# Altium schematic sheet Sheet2.SchDoc
size A3; SheetNumber: 1; SheetTotal: 1
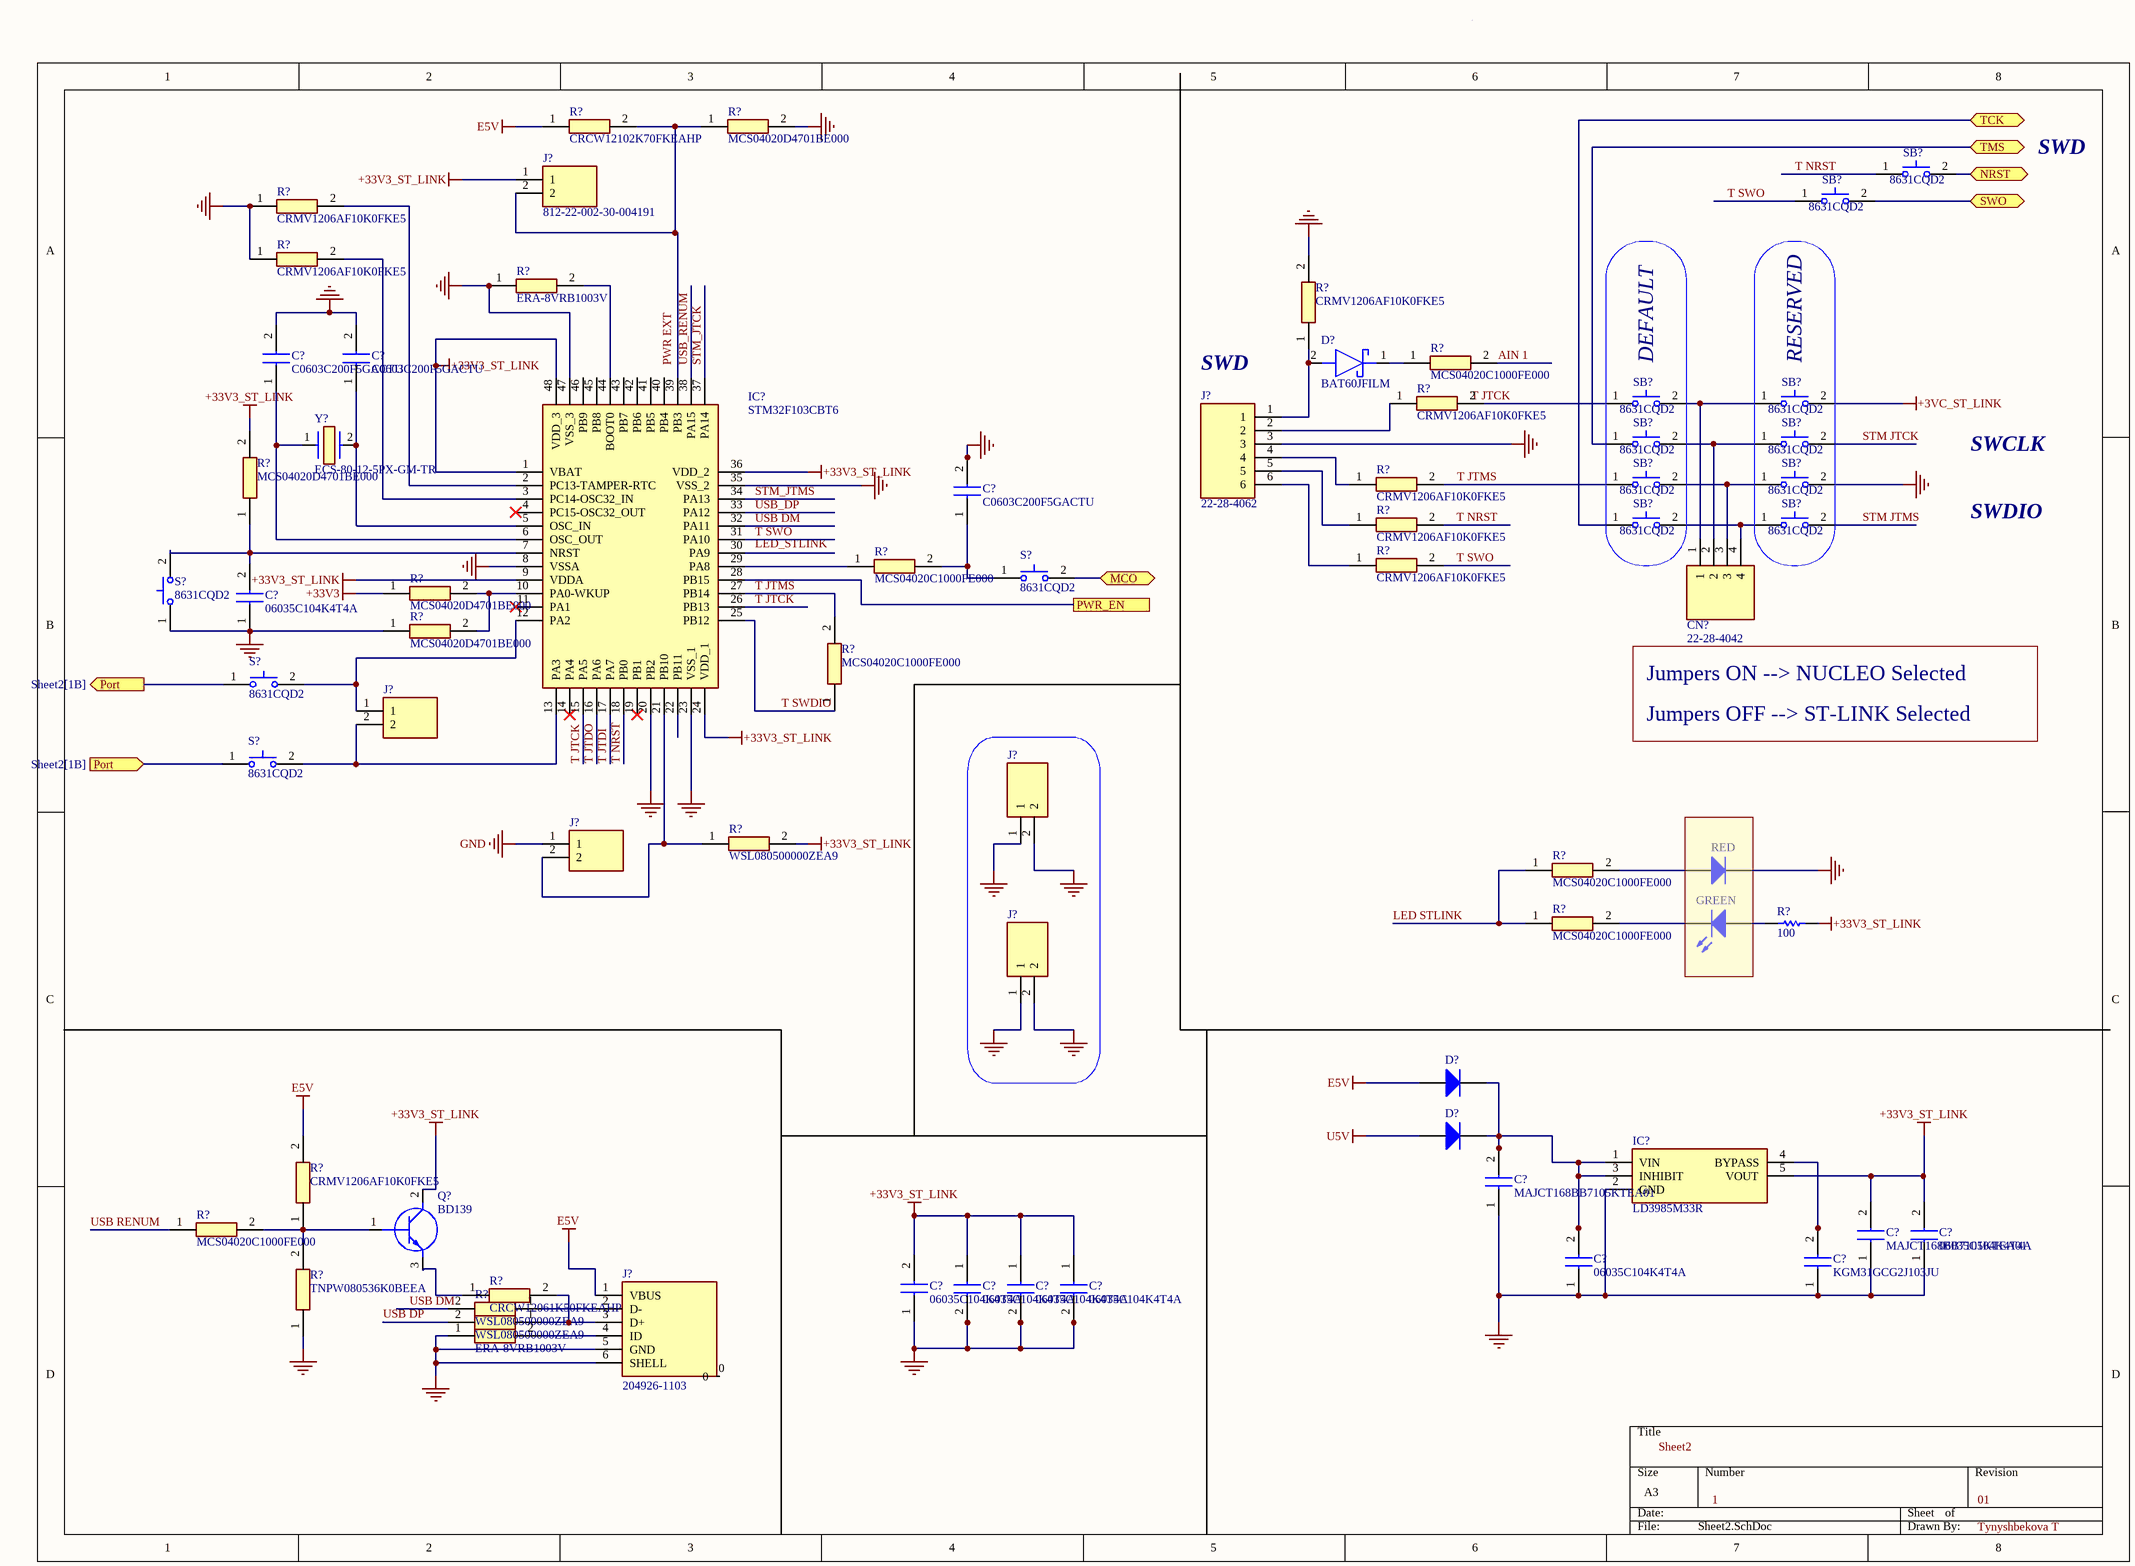
[diagram p0: Sheet2.SchDoc]

## Parts
(Parts that share a designator on the sheet are numbered #1, #2 ... from top to bottom, then left to right.)
C?#1  C0603C200F5GACTU  [CAPC1608X87N]
C?#2  C0603C200F5GACTU  [CAPC1608X87N]
C?#3  C0603C200F5GACTU  [CAPC1608X87N]
C?#4  06035C104K4T4A  [CAPC1608X90N]
C?#5  MAJCT168BB7105KTEA01  [MAJx16]
C?#6  06035C104K4T4A  [CAPC1608X90N]
C?#7  06035C104K4T4A  [CAPC1608X90N]
C?#8  06035C104K4T4A  [CAPC1608X90N]
C?#9  MAJCT168BB7105KTEA01  [MAJx16]
C?#10  06035C104K4T4A  [CAPC1608X90N]
C?#11  06035C104K4T4A  [CAPC1608X90N]
C?#12  KGM31GCG2J103JU  [CAPC3316X145N]
C?#13  06035C104K4T4A  [CAPC1608X90N]
CN?  22-28-4042  [HDRV4W66P0X254_1X4_1016X249X1003P]
D?#1  BAT60JFILM  [SOD2513X117N]
D?#2  Diode  (value not drawn)
D?#3  Diode  (value not drawn)
GREEN  Light-Emitting Diode  (value not drawn)
IC?#1  STM32F103CBT6  [QFP50P900X900X160-48N]
IC?#2  LD3985M33R  [SOT95P280X145-5N]
J?#1  812-22-002-30-004191  [8122200230004191]
J?#2  22-28-4062  [HDRV6W66P0X254_1X6_1524X249X838P]
J?#3  (no value)  [8122200230004191]
J?#4  (no value)  [8122200230004191]
J?#5  (no value)  [8122200230004191]
J?#6  (no value)  [8122200230004191]
J?#7  204926-1103  [2049261103]
Q?  BD139  [TO254P290X760X1320-3P]
R?#1  CRCW12102K70FKEAHP  [RESC3225X70N]
R?#2  MCS04020D4701BE000  [RESC1005X37N]
R?#3  CRMV1206AF10K0FKE5  [RESC3216X74N]
R?#4  CRMV1206AF10K0FKE5  [RESC3216X74N]
R?#5  ERA-8VRB1003V  [ERA8KEB1004V]
R?#6  CRMV1206AF10K0FKE5  [RESC3216X74N]
R?#7  MCS04020C1000FE000  [RESC1005X37N]
R?#8  CRMV1206AF10K0FKE5  [RESC3216X74N]
R?#9  CRMV1206AF10K0FKE5  [RESC3216X74N]
R?#10  MCS04020D4701BE000  [RESC1005X37N]
R?#11  CRMV1206AF10K0FKE5  [RESC3216X74N]
R?#12  CRMV1206AF10K0FKE5  [RESC3216X74N]
R?#13  MCS04020C1000FE000  [RESC1005X37N]
R?#14  MCS04020D4701BE000  [RESC1005X37N]
R?#15  MCS04020D4701BE000  [RESC1005X37N]
R?#16  MCS04020C1000FE000  [RESC1005X37N]
R?#17  WSL080500000ZEA9  [RESC2013X84N]
R?#18  MCS04020C1000FE000  [RESC1005X37N]
R?#19  MCS04020C1000FE000  [RESC1005X37N]
R?#20  value 100  (hidden comment: Resistor)
R?#21  MCS04020C1000FE000  [RESC1005X37N]
R?#22  CRMV1206AF10K0FKE5  [RESC3216X74N]
R?#23  CRCW12061K50FKEAHP  [RESC3116X65N]
R?#24  WSL080500000ZEA9  [RESC2013X84N]
R?#25  WSL080500000ZEA9  [RESC2013X84N]
R?#26  TNPW080536K0BEEA  [RESC2012X55N]
R?#27  ERA-8VRB1003V  [ERA8KEB1004V]
RED  Diode  (value not drawn)
S?#1  8631CQD2  [8631CQD2]
S?#2  8631CQD2  [8631CQD2]
S?#3  8631CQD2  [8631CQD2]
S?#4  8631CQD2  [8631CQD2]
SB?#1  8631CQD2  [8631CQD2]
SB?#2  8631CQD2  [8631CQD2]
SB?#3  8631CQD2  [8631CQD2]
SB?#4  8631CQD2  [8631CQD2]
SB?#5  8631CQD2  [8631CQD2]
SB?#6  8631CQD2  [8631CQD2]
SB?#7  8631CQD2  [8631CQD2]
SB?#8  8631CQD2  [8631CQD2]
SB?#9  8631CQD2  [8631CQD2]
SB?#10  8631CQD2  [8631CQD2]
Y?  ECS-80-12-5PX-GM-TR  [ECS80125PXGMTR]

## Blocks framed on the sheet
DEFAULT: SB?#3 SB?#5 SB?#7 SB?#9
RESERVED: SB?#4 SB?#6 SB?#8 SB?#10

## Ports
MCO (bidir), NRST (bidir), Port (in, see Sheet2[1B]), Port (out, see Sheet2[1B]), PWR_EN, SWO (bidir), TCK (bidir), TMS (bidir)

## Nets
+3VC_ST_LINK: SB?#4.2(N.O._2)
+33V3: R?#14.1
+33V3_ST_LINK: C?#6.1 C?#7.1 C?#8.1 C?#9.2 C?#10.2 C?#13.2 IC?#1.1(VBAT) IC?#1.9(VDDA) IC?#1.24(VDD_1) IC?#1.36(VDD_2) IC?#1.48(VDD_3) IC?#2.5(VOUT) J?#1.1 Q?.2(C) R?#10.2 R?#17.2 R?#20.2
E5V: D?#2.1(A) J?#7.1(VBUS) R?#1.1 R?#22.2
GND: C?#1.2 C?#2.2 C?#3.2 C?#4.1 C?#5.1 C?#6.2 C?#7.2 C?#8.2 C?#9.1 C?#10.1 C?#11.1 C?#12.1 C?#13.1 IC?#1.8(VSSA) IC?#1.20(PB2) IC?#1.23(VSS_1) IC?#1.35(VSS_2) IC?#1.47(VSS_3) IC?#2.2(GND) J?#2.3 J?#4.1 J?#5.1 J?#5.2 J?#6.1 J?#6.2 J?#7.5(GND) J?#7.6(SHELL) R?#2.2 R?#3.1 R?#4.1 R?#5.1 R?#6.2 R?#15.1 R?#26.1 R?#27.1 RED.2(K) S?#2.1(N.O._1) SB?#8.2(N.O._2)
U5V: D?#3.1(A)
AIN 1: R?#7.2
LED STLINK: R?#18.1 R?#19.1
MCO: S?#1.2(N.O._2) ; port MCO
NRST: SB?#1.2(N.O._2) ; port NRST
Port: S?#3.1(N.O._1) S?#4.1(N.O._1) ; port Port
PWR_EN: IC?#1.28(PB15) ; port PWR_EN
STM JTCK: SB?#6.2(N.O._2)
STM JTMS: SB?#10.2(N.O._2)
STM_JTCK: IC?#1.37(PA14)
STM_JTMS: IC?#1.34(PA13)
SWO: SB?#2.2(N.O._2) ; port SWO
T JTCK: IC?#1.15(PA5) IC?#1.26(PB13)
T JTDI: IC?#1.17(PA7)
T JTDO: IC?#1.16(PA6)
T JTMS: IC?#1.27(PB14) R?#9.2 R?#16.2 SB?#7.1(N.O._1)
T NRST: IC?#1.18(PB0) R?#11.2 SB?#1.1(N.O._1)
T SWDIO: IC?#1.25(PB12) R?#16.1
T SWO: IC?#1.31(PA10) R?#12.2 SB?#2.1(N.O._1)
TCK: SB?#9.1(N.O._1) ; port TCK
TMS: SB?#5.1(N.O._1) ; port TMS
USB DM: IC?#1.32(PA11) R?#24.2
USB DP: R?#25.2
USB RENUM: R?#21.1
USB_DP: IC?#1.33(PA12)
USB_RENUM: IC?#1.38(PA15)
NetC?#1_1: C?#1.1 IC?#1.6(OSC_OUT) Y?.1
NetC?#2_1: C?#2.1 IC?#1.5(OSC_IN) Y?.2
NetC?#3_1: C?#3.1 R?#13.2 S?#1.1(N.O._1)
NetC?#4_2: C?#4.2 IC?#1.7(NRST) R?#10.1 S?#2.2(N.O._2)
NetC?#5_2: C?#5.2 C?#11.2 D?#2.2(K) D?#3.2(K) IC?#2.1(VIN) IC?#2.3(INHIBIT)
NetC?#12_2: C?#12.2 IC?#2.4(BYPASS)
NetCN?_1: CN?.1 SB?#3.2(N.O._2) SB?#4.1(N.O._1)
NetCN?_2: CN?.2 SB?#5.2(N.O._2) SB?#6.1(N.O._1)
NetCN?_3: CN?.3 SB?#7.2(N.O._2) SB?#8.1(N.O._1)
NetCN?_4: CN?.4 SB?#9.2(N.O._2) SB?#10.1(N.O._1)
NetD?#1_1: D?#1.1(K) R?#7.1
NetD?#1_2: D?#1.2(A) J?#2.1 R?#6.1
NetGREEN_1: GREEN.1(A) R?#20.1
NetGREEN_2: GREEN.2(K) R?#19.2
NetIC?#1_2: IC?#1.2(PC13-TAMPER-RTC) R?#3.2
NetIC?#1_3: IC?#1.3(PC14-OSC32_IN) R?#4.2
NetIC?#1_10: IC?#1.10(PA0-WKUP) R?#14.2 R?#15.2
NetIC?#1_12: IC?#1.12(PA2) J?#3.1 S?#3.2(N.O._2)
NetIC?#1_13: IC?#1.13(PA3) J?#3.2 S?#4.2(N.O._2)
NetIC?#1_21: IC?#1.21(PB10) J?#4.2 R?#17.1
NetIC?#1_29: IC?#1.29(PA8) R?#13.1
NetIC?#1_39: IC?#1.39(PB3) J?#1.2 R?#1.2 R?#2.1
NetIC?#1_44: IC?#1.44(BOOT0) R?#5.2
NetJ?#2_2: J?#2.2 R?#8.1
NetJ?#2_4: J?#2.4 R?#9.1
NetJ?#2_5: J?#2.5 R?#11.1
NetJ?#2_6: J?#2.6 R?#12.1
NetJ?#7_2: J?#7.2(D-) R?#24.1
NetJ?#7_3: J?#7.3(D+) R?#23.2 R?#25.1
NetJ?#7_4: J?#7.4(ID) R?#27.2
NetQ?_1: Q?.1(B) R?#21.2 R?#22.1 R?#26.2
NetQ?_3: Q?.3(E) R?#23.1
NetR?#8_2: R?#8.2 SB?#3.1(N.O._1)
NetR?#18_2: R?#18.2 RED.1(A)

Not connected (* = marked no-connect by the designer): IC?#1 4(PC15-OSC32_OUT)* 11(PA1)* 14(PA4)* 19(PB1)* 22(PB11) 30(PA9) 40(PB4) 41(PB5) 42(PB6) 43(PB7) 45(PB8) 46(PB9); J?#7 0 MH2 MH3 MH4 MH5 MH6

## Notes on the sheet
- SWD
- (near J?#2) SWD
- SWCLK
- SWDIO
- Jumpers ON --> NUCLEO Selected
- Jumpers OFF --> ST-LINK Selected
- Labels drawn without touching a wire or pin: 1, 01, LED_STLINK, PWR EXT, Sheet2, T JTCK, Tynyshbekova T

## Library data of the parts
C?#1-C?#3 = C0603C200F5GACTU: Capacitor; Manufacturer_Name: KEMET; Datasheet Link: https://content.kemet.com/datasheets/KEM_C1003_C0G_SMD.pdf; Height: 0.87mm; Manufacturer_Part_Number: C0603C200F5GACTU; Mouser Part Number: 80-C0603C200F5GACTU; Mouser Price/Stock: https://www.mouser.co.uk/ProductDetail/KEMET/C0603C200F5GACTU?qs=gt1LBUVyoHmxLY5yAwiOrg%3D%3D; Arrow Part Number: C0603C200F5GACTU; Arrow Price/Stock: https://www.arrow.com/en/products/c0603c200f5gactu/kemet-corporation
C?#4 C?#6-C?#8 C?#10 C?#11 C?#13 = 06035C104K4T4A: Capacitor; Manufacturer_Name: Kyocera AVX; Datasheet Link: https://componentsearchengine.com/Datasheets/1/06031A100FAT2A.pdf; Height: 0.9mm; Manufacturer_Part_Number: 06035C104K4T4A; Mouser Part Number: 581-06035C104K4T4A; Mouser Price/Stock: https://www.mouser.co.uk/ProductDetail/KYOCERA-AVX/06035C104K4T4A?qs=NBj5Hwer2CEXBYKT%252BbuSBA%3D%3D; Arrow Part Number: 06035C104K4T4A; Arrow Price/Stock: https://www.arrow.com/en/products/06035c104k4t4a/avx
C?#5 C?#9 = MAJCT168BB7105KTEA01: Capacitor; Manufacturer_Name: TAIYO YUDEN; Datasheet Link: https://ds.yuden.co.jp/TYCOMPAS/or/detail?pn=MAJCT168BB7105KTEA01; Height: 0.8mm; Manufacturer_Part_Number: MAJCT168BB7105KTEA01
C?#12 = KGM31GCG2J103JU: Capacitor; Manufacturer_Name: Kyocera AVX; Datasheet Link: https://datasheets.kyocera-avx.com/HVKGM.pdf; Height: 1.45mm; Manufacturer_Part_Number: KGM31GCG2J103JU; Mouser Part Number: 581-KGM31GCG2J103JU; Mouser Price/Stock: https://www.mouser.co.uk/ProductDetail/KYOCERA-AVX/KGM31GCG2J103JU?qs=63Lh8XYXgjt6ivbLeGkCxg%3D%3D
CN? = 22-28-4042: Connector; Manufacturer_Name: Molex; Datasheet Link: https://www.molex.com/content/dam/molex/molex-dot-com/products/automated/en-us/salesdrawingpdf/423/42375/022284042_sd.pdf?inline; Height: 10.03mm; Manufacturer_Part_Number: 22-28-4042; Mouser Part Number: 538-22-28-4042; Mouser Price/Stock: https://www.mouser.co.uk/ProductDetail/Molex/22-28-4042?qs=GAPJcf4kvdu6DqYOOlzdaQ%3D%3D
D?#1 = BAT60JFILM: Schottky Diode; Manufacturer_Name: STMicroelectronics; Datasheet Link: https://www.mouser.jp/datasheet/2/389/cd00001944-1795661.pdf; Height: 1.17mm; Manufacturer_Part_Number: BAT60JFILM; Mouser Part Number: 511-BAT60JFILM; Mouser Price/Stock: https://www.mouser.co.uk/ProductDetail/STMicroelectronics/BAT60JFILM?qs=GnFZssByvVVVnMaukcyLZg%3D%3D; Arrow Part Number: BAT60JFILM; Arrow Price/Stock: https://www.arrow.com/en/products/bat60jfilm/stmicroelectronics?region=nac
D?#2 D?#3 RED = Diode: AF: 1; BV: 0; BV_MAX: 1e99; EG: 1.11; FC: 0.5; IBV: 0.001; ISR: 1e-14; MJSW: 0.33; NTUN: 30; TNOM: 27; XTI: 3; SimulationGenericComponent: True; CJO: 0; CJP: 0; CTA: 0; CTP: 0; FCS: 0.5; FV_MAX: 1e99; IKF: 0; IKR: 0; JSW: 0; JTUN: 0; JTUNSW: 0; KEG: 1; KF: 0; LEVEL: 1; N: 1; NBV: 1; NR: 1; NS: 1; PHP: 1; RS: 0; TCV: 0; TLEV: 0; TLEVC: 0; TM1: 0; TM2: 0; TPB: 0; TPHP: 0; TRS: 0; TRS2: 0; TT: 0; TTT1: 0; TTT2: 0; VJ: 1; XTITUN: 3; IS: 1e-14
GREEN = LED: AF: 1; BV: 0; BV_MAX: 1e99; EG: 1.11; FC: 0.5; IBV: 0.001; IS: 1e-14; MJSW: 0.33; NTUN: 30; TNOM: 27; XTI: 3; SimulationGenericComponent: True; CJO: 0; CJP: 0; CTA: 0; CTP: 0; FCS: 0.5; FV_MAX: 1e99; IKF: 0; IKR: 0; ISR: 1e-14; JSW: 0; JTUN: 0; JTUNSW: 0; KEG: 1; KF: 0; LEVEL: 1; N: 1; NBV: 1; NR: 1; NS: 1; PHP: 1; RS: 0; TCV: 0; TLEV: 0; TLEVC: 0; TM1: 0; TM2: 0; TPB: 0; TPHP: 0; TRS: 0; TRS2: 0; TT: 0; TTT1: 0; TTT2: 0; VJ: 1; XTITUN: 3
IC?#1 = STM32F103CBT6: Integrated Circuit; Manufacturer_Name: STMicroelectronics; Datasheet Link: http://www.st.com/st-web-ui/static/active/en/resource/technical/document/datasheet/CD00161566.pdf; Height: 1.6mm; Manufacturer_Part_Number: STM32F103CBT6; Mouser Part Number: 511-STM32F103CBT6; Mouser Price/Stock: https://www.mouser.co.uk/ProductDetail/STMicroelectronics/STM32F103CBT6?qs=WxFF5lh7QM3goh6GV5Ogig%3D%3D; Arrow Part Number: STM32F103CBT6; Arrow Price/Stock: https://www.arrow.com/en/products/stm32f103cbt6/stmicroelectronics?region=europe
IC?#2 = LD3985M33R: Integrated Circuit; Manufacturer_Name: STMicroelectronics; Datasheet Link: http://www.st.com/st-web-ui/static/active/en/resource/technical/document/datasheet/CD00003395.pdf; Height: 1.45mm; Manufacturer_Part_Number: LD3985M33R; Mouser Part Number: 511-LD3985M33R; Mouser Price/Stock: https://www.mouser.co.uk/ProductDetail/STMicroelectronics/LD3985M33R?qs=22WmWNTp1rrPOccVv4HZ7A%3D%3D; Arrow Part Number: LD3985M33R; Arrow Price/Stock: https://www.arrow.com/en/products/ld3985m33r/stmicroelectronics?region=europe
J?#1 J?#3-J?#6 = 812-22-002-30-004191: Connector; Manufacturer_Name: Mill-Max; Datasheet Link: https://www.mill-max.com/products/datasheet/sockets/812-22-002-30-004191; Height: 8.51mm; Manufacturer_Part_Number: 812-22-002-30-004191; Mouser Part Number: 575-8122200230004191; Mouser Price/Stock: https://www.mouser.co.uk/ProductDetail/Mill-Max/812-22-002-30-004191?qs=iJx90KzHWBrdg0l0AGRrFg%3D%3D
J?#2 = 22-28-4062: Connector; Manufacturer_Name: Molex; Datasheet Link: https://datasheet.datasheetarchive.com/originals/distributors/SFDatasheet-1/sf-00031037.pdf; Height: 8.38mm; Manufacturer_Part_Number: 22-28-4062; Mouser Part Number: 538-22-28-4062; Mouser Price/Stock: https://www.mouser.com/Search/Refine.aspx?Keyword=538-22-28-4062
J?#7 = 204926-1103: Connector; Manufacturer_Name: Molex; Datasheet Link: https://www.molex.com/content/dam/molex/molex-dot-com/products/automated/en-us/salesdrawingpdf/204/204926/2049261103_sd.pdf; Height: 4.65mm; Manufacturer_Part_Number: 204926-1103; Mouser Part Number: 538-204926-1103; Mouser Price/Stock: https://www.mouser.co.uk/ProductDetail/Molex/204926-1103?qs=55YtniHzbhBOQihiQOeiLg%3D%3D; Arrow Part Number: 204926-1103; Arrow Price/Stock: https://www.arrow.com/en/products/204926-1103/molex?region=nac
Q? = BD139: Transistor BJT NPN; Manufacturer_Name: STMicroelectronics; Datasheet Link: http://www.st.com/web/en/resource/technical/document/datasheet/CD00001225.pdf; Height: 2.9mm; Manufacturer_Part_Number: BD139; Mouser Part Number: 511-BD139; Mouser Price/Stock: https://www.mouser.co.uk/ProductDetail/STMicroelectronics/BD139?qs=ljbEvF4DwOPW%2FLxHSWYMMA%3D%3D; Arrow Part Number: BD139; Arrow Price/Stock: https://www.arrow.com/en/products/bd139/stmicroelectronics?region=europe
R?#1 = CRCW12102K70FKEAHP: Resistor; Manufacturer_Name: Vishay; Datasheet Link: http://componentsearchengine.com/Datasheets/1/CRCW12102K70FKEAHP.pdf; Height: 0.7mm; Manufacturer_Part_Number: CRCW12102K70FKEAHP; Mouser Part Number: 71-CRCW12102K70FKEAH; Mouser Price/Stock: https://www.mouser.co.uk/ProductDetail/Vishay-Dale/CRCW12102K70FKEAHP?qs=OAzHGkhREL0m0%252BU1n6AaAg%3D%3D
R?#2 R?#10 R?#14 R?#15 = MCS04020D4701BE000: Resistor; Manufacturer_Name: Vishay; Datasheet Link: http://www.vishay.com/docs/28705/mcx0x0xpro.pdf; Height: 0.37mm; Manufacturer_Part_Number: MCS04020D4701BE000; Mouser Part Number: 594-MCS04020D4701BE0; Mouser Price/Stock: https://www.mouser.co.uk/ProductDetail/Vishay-Beyschlag/MCS04020D4701BE000?qs=ft9OtscSA3%252BR0DpF5QqL2Q%3D%3D
R?#3 R?#4 R?#6 R?#8 R?#9 R?#11 R?#12 R?#22 = CRMV1206AF10K0FKE5: Resistor; Manufacturer_Name: Vishay; Datasheet Link: https://www.vishay.com/docs/68037/crmv.pdf; Height: 0.74mm; Manufacturer_Part_Number: CRMV1206AF10K0FKE5; Mouser Part Number: 71-RMV1206AF10K0FKE5; Mouser Price/Stock: https://www.mouser.co.uk/ProductDetail/Vishay-Techno/CRMV1206AF10K0FKE5?qs=l8RvIzyJx4lLA%2F4RSSc%2F9A%3D%3D
R?#5 R?#27 = ERA-8VRB1003V: Resistor; Manufacturer_Name: Panasonic; Datasheet Link: https://industrial.panasonic.com/cdbs/www-data/pdf/RDM0000/RDM0000C331.pdf; Height: 0.65mm; Manufacturer_Part_Number: ERA-8VRB1003V; Mouser Part Number: 667-ERA-8VRB1003V; Mouser Price/Stock: https://www.mouser.co.uk/ProductDetail/Panasonic/ERA-8VRB1003V?qs=By6Nw2ByBD3GbaEFFbsd4A%3D%3D
R?#7 R?#13 R?#16 R?#18 R?#19 R?#21 = MCS04020C1000FE000: Resistor; Manufacturer_Name: Vishay; Datasheet Link: http://www.vishay.com/docs/28705/mcx0x0xpro.pdf; Height: 0.37mm; Manufacturer_Part_Number: MCS04020C1000FE000; Mouser Part Number: 594-MCS04020C1000FE0; Mouser Price/Stock: https://www.mouser.co.uk/ProductDetail/Vishay-Beyschlag/MCS04020C1000FE000?qs=7ZE6F4QMOBYkwvQlfbkT8w%3D%3D; Arrow Part Number: MCS04020C1000FE000; Arrow Price/Stock: https://www.arrow.com/en/products/mcs04020c1000fe000/vishay
R?#17 R?#24 R?#25 = WSL080500000ZEA9: Resistor; Manufacturer_Name: Vishay; Datasheet Link: https://ad.componentsearchengine.com/Datasheets/2/WSL080500000ZEA9.pdf; Height: 0.838mm; Manufacturer_Part_Number: WSL080500000ZEA9; Mouser Part Number: 71-WSL080500000ZEA9; Mouser Price/Stock: https://www.mouser.co.uk/ProductDetail/Vishay-Dale/WSL080500000ZEA9?qs=f1l5vAGoKgsImKS87N8TmQ%3D%3D; Arrow Part Number: WSL080500000ZEA9; Arrow Price/Stock: https://www.arrow.com/en/products/wsl080500000zea9/vishay?region=nac
R?#20 = Resistor: TC1: 0; SimulationGenericComponent: True; TC2: 0
R?#23 = CRCW12061K50FKEAHP: Resistor; Manufacturer_Name: Vishay; Datasheet Link: http://componentsearchengine.com/Datasheets/1/CRCW12061K50FKEAHP.pdf; Height: 0.65mm; Manufacturer_Part_Number: CRCW12061K50FKEAHP; Mouser Part Number: 71-CRCW12061K50FKEAH; Mouser Price/Stock: https://www.mouser.co.uk/ProductDetail/Vishay-Dale/CRCW12061K50FKEAHP?qs=k2%2FDWSARqgEwHXAQbL4aEg%3D%3D; Arrow Part Number: CRCW12061K50FKEAHP; Arrow Price/Stock: https://www.arrow.com/en/products/crcw12061k50fkeahp/vishay?region=nac
R?#26 = TNPW080536K0BEEA: Resistor; Manufacturer_Name: Vishay; Datasheet Link: https://www.vishay.com/docs/31006/tnpw.pdf; Height: 0.55mm; Manufacturer_Part_Number: TNPW080536K0BEEA
S?#1-S?#4 SB?#1-SB?#10 = 8631CQD2: Switch (2-Pin Push); Manufacturer_Name: C & K COMPONENTS; Datasheet Link: https://www.ckswitches.com/media/1396/8600.pdf; Height: 13.93mm; Manufacturer_Part_Number: 8631CQD2; Mouser Part Number: 611-8631-261; Mouser Price/Stock: https://www.mouser.co.uk/ProductDetail/CK/8631CQD2?qs=ktcBc77oICXe9iPhfEwnkA%3D%3D
Y? = ECS-80-12-5PX-GM-TR: Crystal or Oscillator; Manufacturer_Name: ECS; Datasheet Link: https://ecsxtal.com/store/pdf/csm-7x.pdf; Height: 4.3mm; Manufacturer_Part_Number: ECS-80-12-5PX-GM-TR; Mouser Part Number: 520-80-12-5PX-GM-TR; Mouser Price/Stock: https://www.mouser.co.uk/ProductDetail/ECS/ECS-80-12-5PX-GM-TR?qs=amGC7iS6iy%252BwzUdIY7WpOA%3D%3D